# Altium project uppsense.PrjPcb
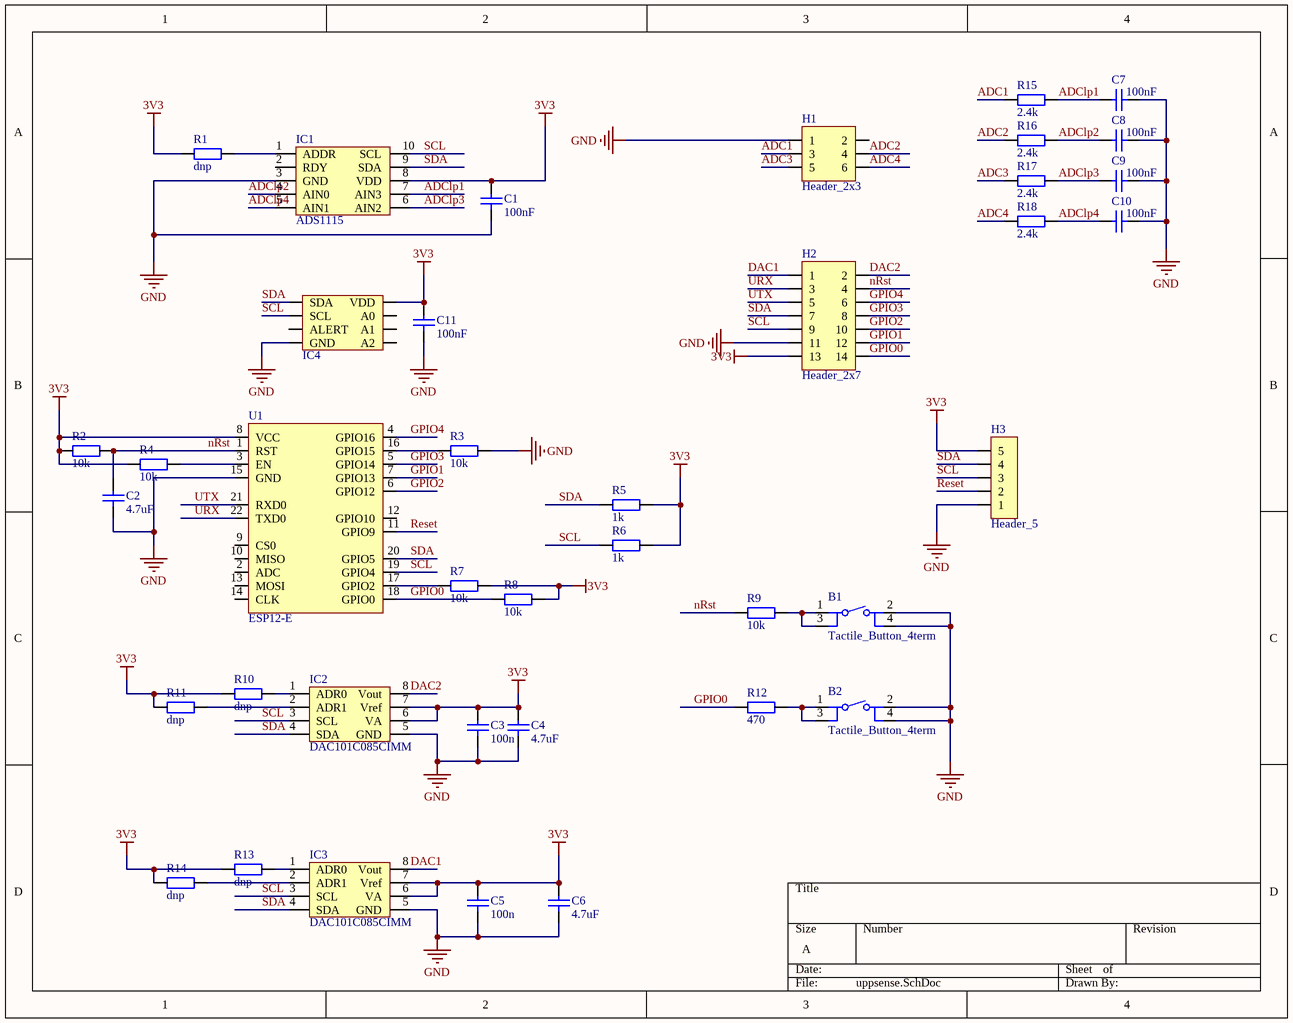
[diagram p0: uppsense.SchDoc]
1 sheet, 39 parts. Net scope: global (net labels, ports and power ports of the same name join across sheets).
Board file: uppsense.PcbDoc

## Sheet uppsense.SchDoc
size A

### Parts
B1  Tactile_Button_4term  [TACTILE_MINATUE_SMD_6x6mm]
B2  Tactile_Button_4term  [TACTILE_MINATUE_SMD_6x6mm]
C1  100nF  [C0603]
C2  4.7uF  [C0603]
C3  100n  [C0603]
C4  4.7uF  [C0603]
C5  100n  [C0603]
C6  4.7uF  [C0603]
C7  100nF  [C0603]
C8  100nF  [C0603]
C9  100nF  [C0603]
C10  100nF  [C0603]
C11  100nF  [C0603]
H1  Header_2x3  [HEADER_MALE_2x3_RIGHT_ANGLE]
H2  Header_2x7  [HEADER_MALE_2x7_RIGHT_ANGLE]
H3  Header_5  [Header_MALE_0.05INCH_5]
IC1  ADS1115  [10-VSSOP-0.5]
IC2  DAC101C085CIMM  [8-VSSOP]
IC3  DAC101C085CIMM  [8-VSSOP]
IC4  MCP9808  [8-MSOP]  (value not drawn)
R1  dnp  [R0603]
R2  10k  [R0603]
R3  10k  [R0603]
R4  10k  [R0603]
R5  1k  [R0603]
R6  1k  [R0603]
R7  10k  [R0603]
R8  10k  [R0603]
R9  10k  [R0603]
R10  dnp  [R0603]
R11  dnp  [R0603]
R12  470  [R0603]
R13  dnp  [R0603]
R14  dnp  [R0603]
R15  2.4k  [R0603]
R16  2.4k  [R0603]
R17  2.4k  [R0603]
R18  2.4k  [R0603]
U1  ESP12-E  [ESP12-E]

### Nets
3V3: C1.1 C3.1 C4.1 C5.1 C6.1 C11.1 H2.13 H3.5 IC1.8(VDD) IC2.6(VA) IC2.7(Vref) IC3.6(VA) IC3.7(Vref) IC4.8(VDD) R1.2 R2.2 R4.2 R5.1 R6.1 R7.1 R8.1 R10.2 R11.2 R13.2 R14.2 U1.8(VCC)
GND: B1.2 B1.4 B2.2 B2.4 C1.2 C2.2 C3.2 C4.2 C5.2 C6.2 C7.2 C8.2 C9.2 C10.2 C11.2 H1.1 H2.11 H3.1 IC1.3(GND) IC2.5(GND) IC3.5(GND) IC4.4(GND) R3.1 U1.15(GND)
ADC1: H1.3 R15.2
ADC2: H1.4 R16.2
ADC3: H1.5 R17.2
ADC4: H1.6 R18.2
ADClp1: C7.1 IC1.7(AIN3) R15.1
ADClp2: C8.1 IC1.4(AIN0) R16.1
ADClp3: C9.1 IC1.6(AIN2) R17.1
ADClp4: C10.1 IC1.5(AIN1) R18.1
DAC1: H2.1 IC3.8(Vout)
DAC2: H2.2 IC2.8(Vout)
GPIO0: H2.14 R8.2 R12.2 U1.18(GPIO0)
GPIO1: H2.12 U1.7(GPIO13)
GPIO2: H2.10 U1.6(GPIO12)
GPIO3: H2.8 U1.5(GPIO14)
GPIO4: H2.6 U1.4(GPIO16)
nRst: C2.1 H2.4 R2.1 R9.2 U1.1(RST)
Reset: H3.2 U1.11(GPIO9)
SCL: H2.9 H3.3 IC1.10(SCL) IC2.3(SCL) IC3.3(SCL) IC4.2(SCL) R6.2 U1.19(GPIO4)
SDA: H2.7 H3.4 IC1.9(SDA) IC2.4(SDA) IC3.4(SDA) IC4.1(SDA) R5.2 U1.20(GPIO5)
URX: H2.3 U1.22(TXD0)
UTX: H2.5 U1.21(RXD0)
NetB1_1: B1.1 B1.3 R9.1
NetB2_1: B2.1 B2.3 R12.1
NetIC1_1: IC1.1(ADDR) R1.1
NetIC2_1: IC2.1(ADR0) R10.1
NetIC2_2: IC2.2(ADR1) R11.1
NetIC3_1: IC3.1(ADR0) R13.1
NetIC3_2: IC3.2(ADR1) R14.1
NetR3_2: R3.2 U1.16(GPIO15)
NetR4_1: R4.1 U1.3(EN)
NetR7_2: R7.2 U1.17(GPIO2)

Not connected (* = marked no-connect by the designer): H1 2; IC1 2(RDY); IC4 3(ALERT) 5(A2) 6(A1) 7(A0); U1 2(ADC) 9(CS0) 10(MISO) 12(GPIO10) 13(MOSI) 14(CLK)

### Library data of the parts
C1-C11 = Capacitor: Schematic symbol of a capacitor
H1 = Header_2x3: Generic 6pin header symbol
H2 = Header_2x7: Generic 14pin header symbol
H3 = Header_5: Generic 5pin header symbol; Supplier 1: Digi-Key; Supplier Part Number 1: S1012EC-40-ND
IC1 = ADS1115: ADS111x  Ultra-Small,  Low-Power,  I  2  C-Compatible,  860-SPS,  16-Bit  ADCs
IC2 IC3 = DAC101C085CIMM: DAC101C08xx  10-Bit  Micro Power  Digital-to-Analog  Converter  With an I  2  C-Compatible  Interface
IC4 = MCP9808: v±0.5°C Maximum Accuracy   Digital Temperature Sensor
R1-R18 = Resistor: Schematic symbol of a resistor